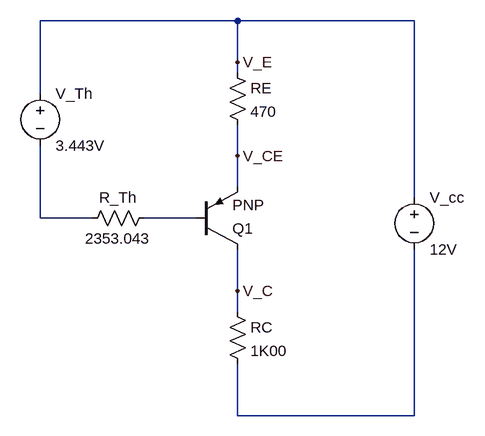
[diagram p0: schematic Draft14.asc]
Draft14.asc, the LTspice schematic file:
Version 4
SHEET 1 880 680
WIRE 192 -96 -112 -96
WIRE 464 -96 192 -96
WIRE 192 -32 192 -96
WIRE 192 -16 192 -32
WIRE -112 16 -112 -96
WIRE 192 112 192 64
WIRE 192 160 192 112
WIRE 464 176 464 -96
WIRE -112 208 -112 96
WIRE -32 208 -112 208
WIRE 128 208 48 208
WIRE 192 320 192 256
WIRE 192 352 192 320
WIRE 192 512 192 432
WIRE 464 512 464 256
WIRE 464 512 192 512
FLAG 192 -32 V_E
FLAG 192 320 V_C
FLAG 192 112 V_CE
SYMBOL pnp 128 256 M180
SYMATTR InstName Q1
SYMBOL res 176 -32 R0
SYMATTR InstName RE
SYMATTR Value 470
SYMBOL res 176 336 R0
SYMATTR InstName RC
SYMATTR Value 1K00
SYMBOL voltage 464 160 R0
WINDOW 123 0 0 Left 0
WINDOW 39 0 0 Left 0
SYMATTR InstName V_cc
SYMATTR Value 12V
SYMBOL voltage -112 0 R0
SYMATTR InstName V_Th
SYMATTR Value 3.443V
SYMBOL res 64 192 R90
WINDOW 0 0 56 VBottom 2
WINDOW 3 32 56 VTop 2
SYMATTR InstName R_Th
SYMATTR Value 2353.043

The netlist it stands for:
* Draft14.asc
Q1 V_C N002 V_CE 0 PNP
RE V_E V_CE 470
RC V_C N003 1K00
V_cc V_E N003 12V
V_Th V_E N001 3.443V
R_Th N002 N001 2353.043
.model NPN NPN
.model PNP PNP
.lib standard.bjt
.backanno
.end